# Altium schematic sheet JaidonHillBootcamp.SchDoc
size 279 x 215 mm; SheetNumber: 1; SheetTotal: 1
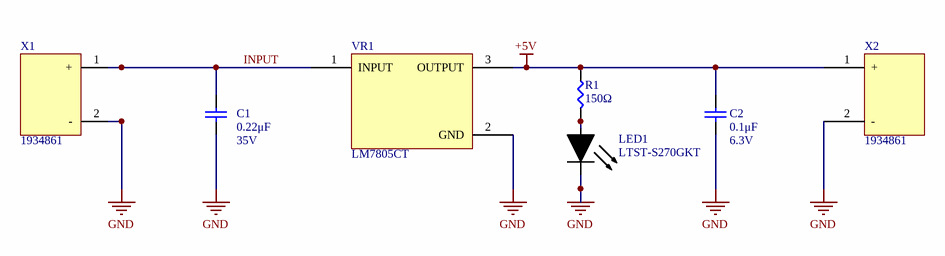
[diagram p0: JaidonHillBootcamp.SchDoc]

## Parts
C1  value 0.22μF  Voltage Rating: 35V  [CAP0402]  (hidden comment: CGA2B1X7R1V224K050BC)
C2  value 0.1μF  Voltage Rating: 6.3V  [CAP0201]  (hidden comment: CL03A104KQ3NNNC)
LED1  LTST-S270GKT  [LTST-S270GKT]
R1  value 150Ω  [RES0603]  (hidden comment: RC0603FR-07150RL)
VR1  LM7805CT  [TO-220-3]
X1  1934861  [1934861]
X2  1934861  [1934861]

## Nets
+5V: C2.2 R1.2 VR1.3(OUTPUT) X2.1(+)
GND: C1.1 C2.1 LED1.1 VR1.2(GND) X1.2(-) X2.2(-)
INPUT: C1.2 VR1.1(INPUT) X1.1(+)
NetLED1_2: LED1.2 R1.1

## Notes on the sheet
- Waterloo Aerial Robotics Group
- 200 University Ave W
- PROJECT
- Waterloo, Ontario, Canada
- N2L 3G1
- REVISION
- DOCUMENT
- ENGINEER
- REVIEWER
- MODIFIED
- SHEET
- OF

## Library data of the parts
C1 = CGA2B1X7R1V224K050BC: CAP CER 0.22UF 35V X7R 0402; Manufacturer 1: TDK Corporation; Supplier 1: Digi-Key; Manufacturer Part Number 1: CGA2B1X7R1V224K050BC; Supplier Part Number 1: 445-174422-2-ND
C2 = CL03A104KQ3NNNC: CAP CER 0.1UF 6.3V X5R 0201; Manufacturer 1: Samsung Electro-Mechanics; Supplier 1: Digi-Key; Manufacturer Part Number 1: CL03A104KQ3NNNC; Supplier Part Number 1: 1276-1013-2-ND
LED1 = LTST-S270GKT: LED GREEN CLEAR SMD R/A; Manufacturer 1: Lite-On Inc.; Manufacturer Part Number 1: LTST-S270GKT; Supplier 1: Digikey; Supplier Part Number 1: 160-1475-2-ND
R1 = RC0603FR-07150RL: RES 150 OHM 1% 1/10W 0603; Manufacturer 1: Yageo; Manufacturer Part Number 1: RC0603FR-07150RL; Supplier Part Number 1: 311-150HRTR-ND; Supplier 1: Digi-Key; Power Rating: 1/10W
VR1 = LM7805CT: Linear Voltage Regulators 1.5-A, 35-V, linear voltage regulator 3-TO-220 0 to 125; Manufacturer 1: Texas Instruments; Manufacturer Part Number 1: LM7805CT; Supplier 1: Mouser; Supplier Part Number 1: 926-LM7805CT